# Altium schematic sheet FC-SE2014-220M1_FC-SE2014-220M.schdoc.schdoc
size 127 x 99 mm
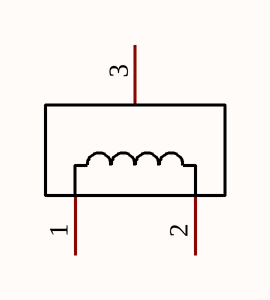
[diagram p0: FC-SE2014-220M1_FC-SE2014-220M.schdoc.schdoc]

## Parts
L?  FC-SE2014-220M  [IND-SMD_FC-SE2014-220M]  (value not drawn)

## Nets

Not connected (* = marked no-connect by the designer): L? 1 2 3

## Library data of the parts
L? = FC-SE2014-220M: Manufacturer: FC(方成); Value: 22uH; Add into BOM: yes; Tolerance: ±20%; Rated Current: 12A; Saturation Current (Isat): 15A; DC Resistance (DCR): 10.65mΩ; Symbol: FC-SE2014-220M; Device: FC-SE2014-220M; Supplier: LCSC; Supplier Part: C2936076; Manufacturer Part: FC-SE2014-220M; JLCPCB Part Class: Extended Part; LCSC Part Name: 22uH ±20% 15A; Supplier Footprint: SMD; Datasheet: https://atta.szlcsc.com/upload/public/pdf/source/20231130/738442A4ED214BE79B9177FDEB7E4F55.pdf; Convert to PCB: yes; Ratings: -